# EAGLE schematic sms_adapter (EAGLE 7.6.0)
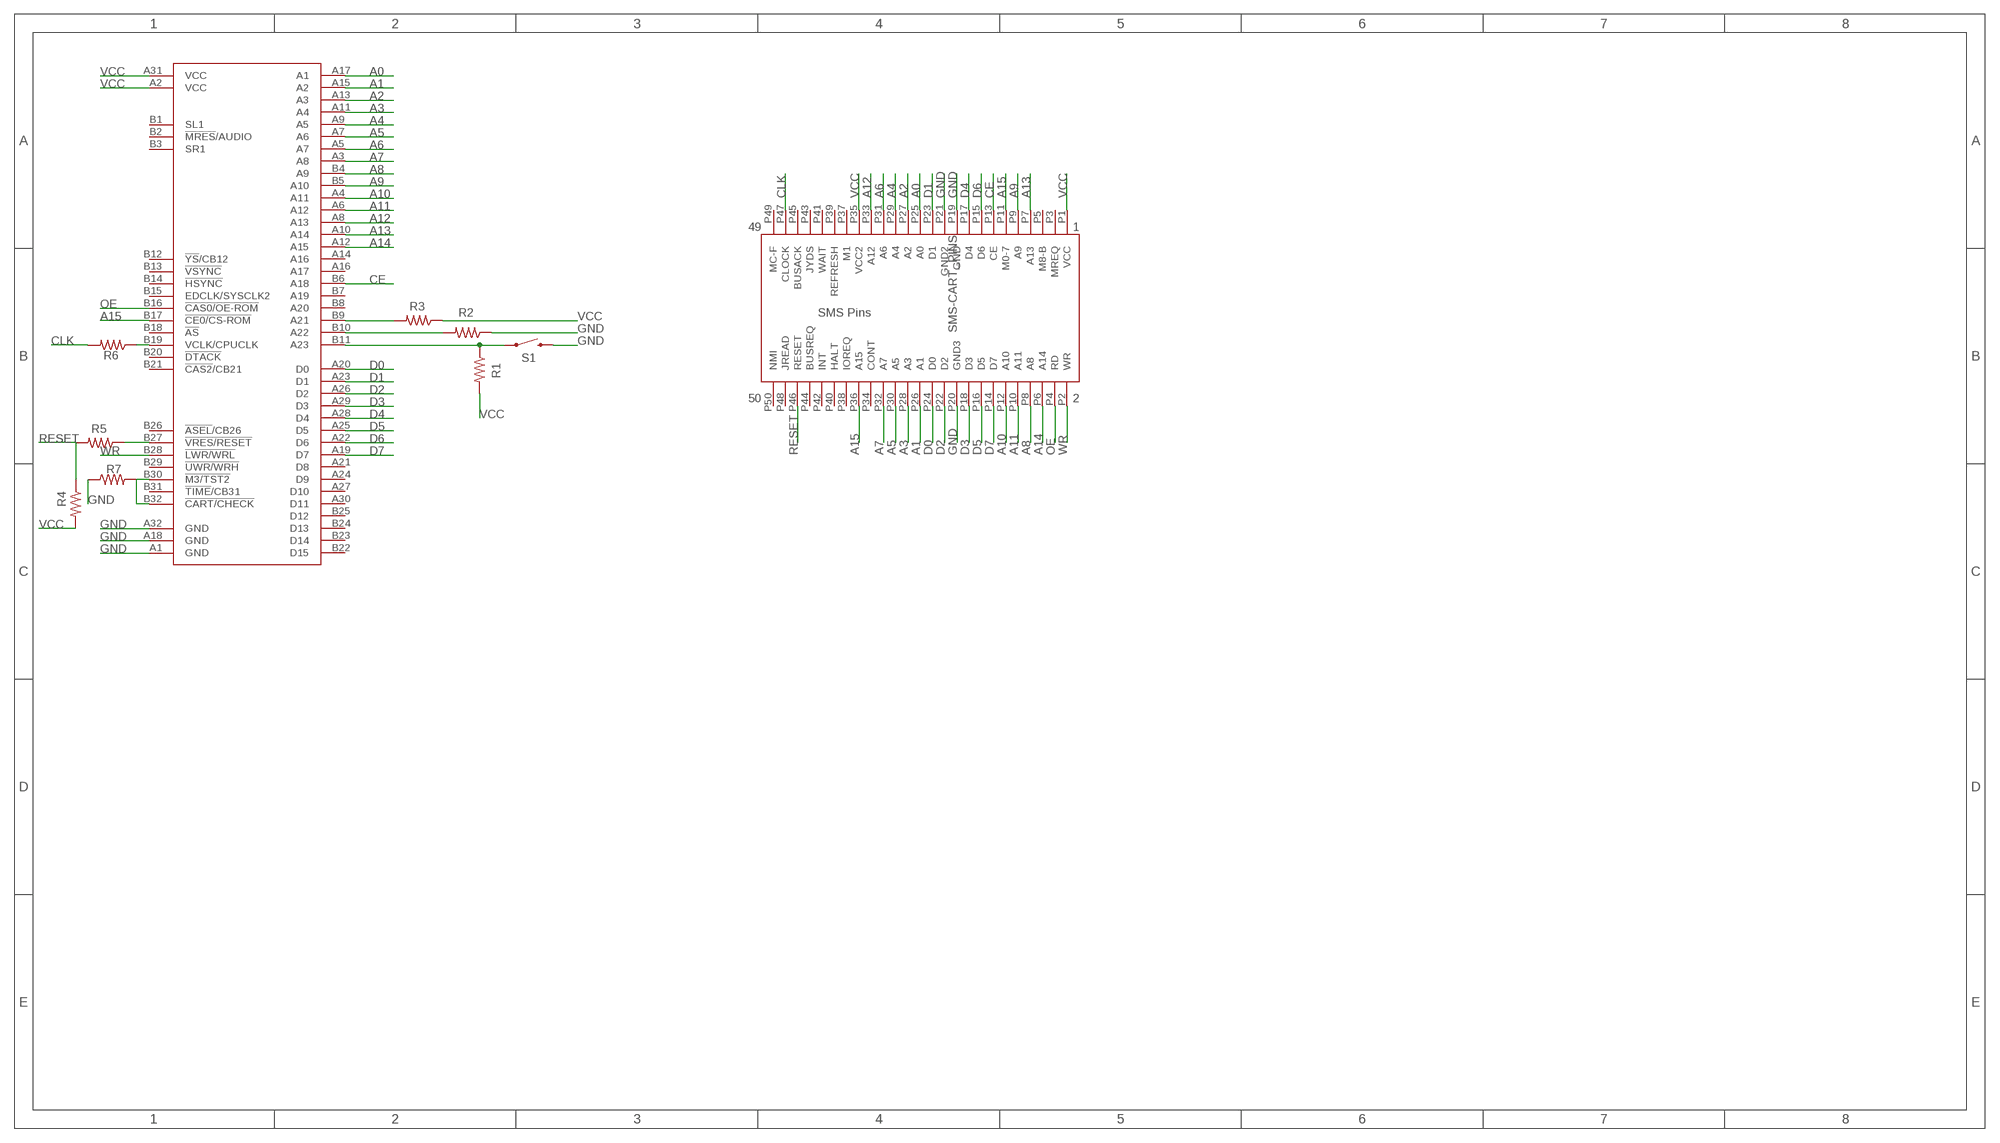
[diagram p0: schematic, sheet 1]

## Parts
CN3  MEGADRIVE-CART-CONNECTOR-ORDERED  [MEGADRIVE-CART-CONNECTOR]
R1  56K  R-US_M1206  [M1206]
R2  0  R-US_M1206  [M1206]
R3  0  R-US_M1206  [M1206]
R4  0  R-US_M1206  [M1206]
R5  NP  R-US_M1206  [M1206]
R6  NP  R-US_M1206  [M1206]
R7  0  R-US_M1206  [M1206]
S1  MOMENTARY-SWITCH-SPST-SMD-5.2MM  [TACTILE_SWITCH_SMD_5.2MM]
U$1  SMS-CART_PINS  [SMS_PINS]

## Nets
A0: CN3.A17(A1) U$1.P25(A0)
A1: CN3.A15(A2) U$1.P26(A1)
A2: CN3.A13(A3) U$1.P27(A2)
A3: CN3.A11(A4) U$1.P28(A3)
A4: CN3.A9(A5) U$1.P29(A4)
A5: CN3.A7(A6) U$1.P30(A5)
A6: CN3.A5(A7) U$1.P31(A6)
A7: CN3.A3(A8) U$1.P32(A7)
A8: CN3.B4(A9) U$1.P8(A8)
A9: CN3.B5(A10) U$1.P9(A9)
A10: CN3.A4(A11) U$1.P12(A10)
A11: CN3.A6(A12) U$1.P10(A11)
A12: CN3.A8(A13) U$1.P33(A12)
A13: CN3.A10(A14) U$1.P7(A13)
A14: CN3.A12(A15) U$1.P6(A14)
A15: CN3.B17(!CE0/CS-ROM) U$1.P11(M0-7) U$1.P36(A15)
CE: CN3.B6(A18) U$1.P13(CE)
CLK: R6.2 U$1.P47(CLOCK)
D0: CN3.A20(D0) U$1.P24(D0)
D1: CN3.A23(D1) U$1.P23(D1)
D2: CN3.A26(D2) U$1.P22(D2)
D3: CN3.A29(D3) U$1.P18(D3)
D4: CN3.A28(D4) U$1.P17(D4)
D5: CN3.A25(D5) U$1.P16(D5)
D6: CN3.A22(D6) U$1.P15(D6)
D7: CN3.A19(D7) U$1.P14(D7)
GND [gnd]: CN3.A1(GND) CN3.A18(GND) CN3.A32(GND) R2.1 R7.1 S1.3 U$1.P19(GND) U$1.P20(GND3) U$1.P21(GND2)
N$1: CN3.B11(A23) R1.1 S1.1
N$2: CN3.B10(A22) R2.2
N$3: CN3.B9(A21) R3.2
N$4: CN3.B19(VCLK/CPUCLK) R6.1
N$5: CN3.B30(!M3/TST2) CN3.B32(!CART/CHECK) R7.2
N$6: CN3.B27(!VRES/RESET) R5.1
OE: CN3.B16(!CAS0/OE-ROM) U$1.P4(RD)
RESET: R4.1 R5.2 U$1.P46(RESET)
VCC [power]: CN3.A2(VCC) CN3.A31(VCC) R1.2 R3.1 R4.2 U$1.P1(VCC) U$1.P35(VCC2)
WR: CN3.B28(!LWR/WRL) U$1.P2(WR)
Unconnected: CN3.A14(A16) CN3.A16(A17) CN3.A21(D8) CN3.A24(D9) CN3.A27(D10) CN3.A30(D11) CN3.B1(SL1) CN3.B2(!MRES!/AUDIO) CN3.B3(SR1) CN3.B7(A19) CN3.B8(A20) CN3.B12(!YS!/CB12) CN3.B13(!VSYNC) CN3.B14(!HSYNC) CN3.B15(EDCLK/SYSCLK2) CN3.B18(!AS) CN3.B20(!DTACK) CN3.B21(!CAS2!/CB21) CN3.B22(D15) CN3.B23(D14) CN3.B24(D13) CN3.B25(D12) CN3.B26(!ASEL!/CB26) CN3.B29(!UWR/WRH) CN3.B31(!TIME!/CB31) U$1.P3(MREQ) U$1.P5(M8-B) U$1.P34(CONT) U$1.P37(M1) U$1.P38(IOREQ) U$1.P39(REFRESH) U$1.P40(HALT) U$1.P41(WAIT) U$1.P42(INT) U$1.P43(JYDS) U$1.P44(BUSREQ) U$1.P45(BUSACK) U$1.P48(JREAD) U$1.P49(MC-F) U$1.P50(NMI)

## Library data of the parts
CN3 = arcadetv:MEGADRIVE-CART-CONNECTOR-ORDERED
R1-R7 = adafruit:R-US_: RESISTOR, American symbol
S1 = !sanni:MOMENTARY-SWITCH-SPST: Momentary Switch (Pushbutton) - SPST Normally-open (NO) SPST momentary switches (buttons, pushbuttons). Variants PTH-12MM - 12mm square, through-hole Momentary Pushbutton Switch - 12mm Square <https://www.sparkfun.com/products/9190> (COM-09190) PTH-6.0MM, PTH-6.0MM-KIT - 6.0mm square, through-hole Mini Pushbutton Switch <https://www.sparkfun.com/products/97> (COM-00097) KIT package intended for soldering kit's - only one side of pads' copper is exposed. PTH-RIGHT-ANGLE-KIT - Right-angle, through-hole Right Angle Tactile Button <https://www.sparkfun.com/products/10791> - Used on SparkFun BigTime Watch Kit <https://www.sparkfun.com/products/11734> SMD-12MM - 12mm square, surface-mount Tactile Button - SMD (12mm) <https://www.sparkfun.com/products/12993> (COM-12993) Used on SparkFun PicoBoard <https://www.sparkfun.com/products/11888> SMD-4.5MM - 4.5mm Square Trackball Switch Used on SparkFun Blackberry Trackballer Breakout <https://www.sparkfun.com/products/13169> SMD-4.6MMX2.8MM - 4.60mm x 2.80mm, surface mount Used on SparkFun SAMD21 Mini Breakout <https://www.sparkfun.com/products/13664> SMD-5.2MM, SMD-5.2-REDUNDANT - 5.2mm square, surface-mount Mini Pushbutton Switch - SMD <https://www.sparkfun.com/products/8720> (COM-08720) Used on Arduino Pro Mini <https://www.sparkfun.com/products/11114> REDUNDANT package connects both switch circuits together SMD-6.0X3.5MM - 6.0 x 3.5mm, surface mount Momentary Reset Switch SMD <https://www.sparkfun.com/products/8229> (COM-08229) SMD-6.2MM-TALL - 6.2mm square, surface mount Tactile Button - SMD (6mm) <https://www.sparkfun.com/products/12992> Used on SparkFun Digital Sandbox <https://www.sparkfun.com/products/12651> SMD-RIGHT-ANGLE - Right-angle, surface mount Used on SparkFun Block for Intel® Edison - Arduino <https://www.sparkfun.com/products/13036>; PROD_ID: SWCH-08247; SF_SKU: COM-08720
U$1 = !sanni_mod4:SMS-CART_PINS

## Net classes
0 default: width 0.254 mm, drill 0.305 mm, clearance 0.203 mm
1 power: width 0.61 mm, drill 0.406 mm, clearance 0.203 mm
2 gnd: width 0.61 mm, drill 0.406 mm, clearance 0.203 mm
3 power usb: width 0.61 mm, drill 0.406 mm, clearance 0.203 mm